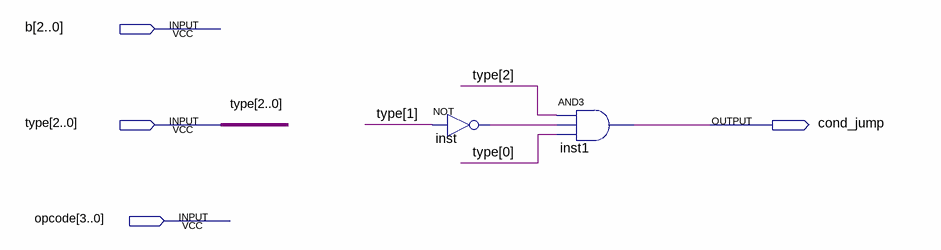
[diagram p0: schematic sheet]
// Quartus schematic conditional_jump.bdf as structural Verilog: 2 symbols, 4 pins
module conditional_jump (
  input  [2:0] b,
  input  [2:0] \type ,
  input  [3:0] opcode,
  output cond_jump
);

  wire inst_out;

  not inst (inst_out, \type [1]);
  and inst1 (cond_jump, \type [2], inst_out, \type [0]);
endmodule
